# EAGLE design riffleito-REVG (EAGLE 6.5.0)
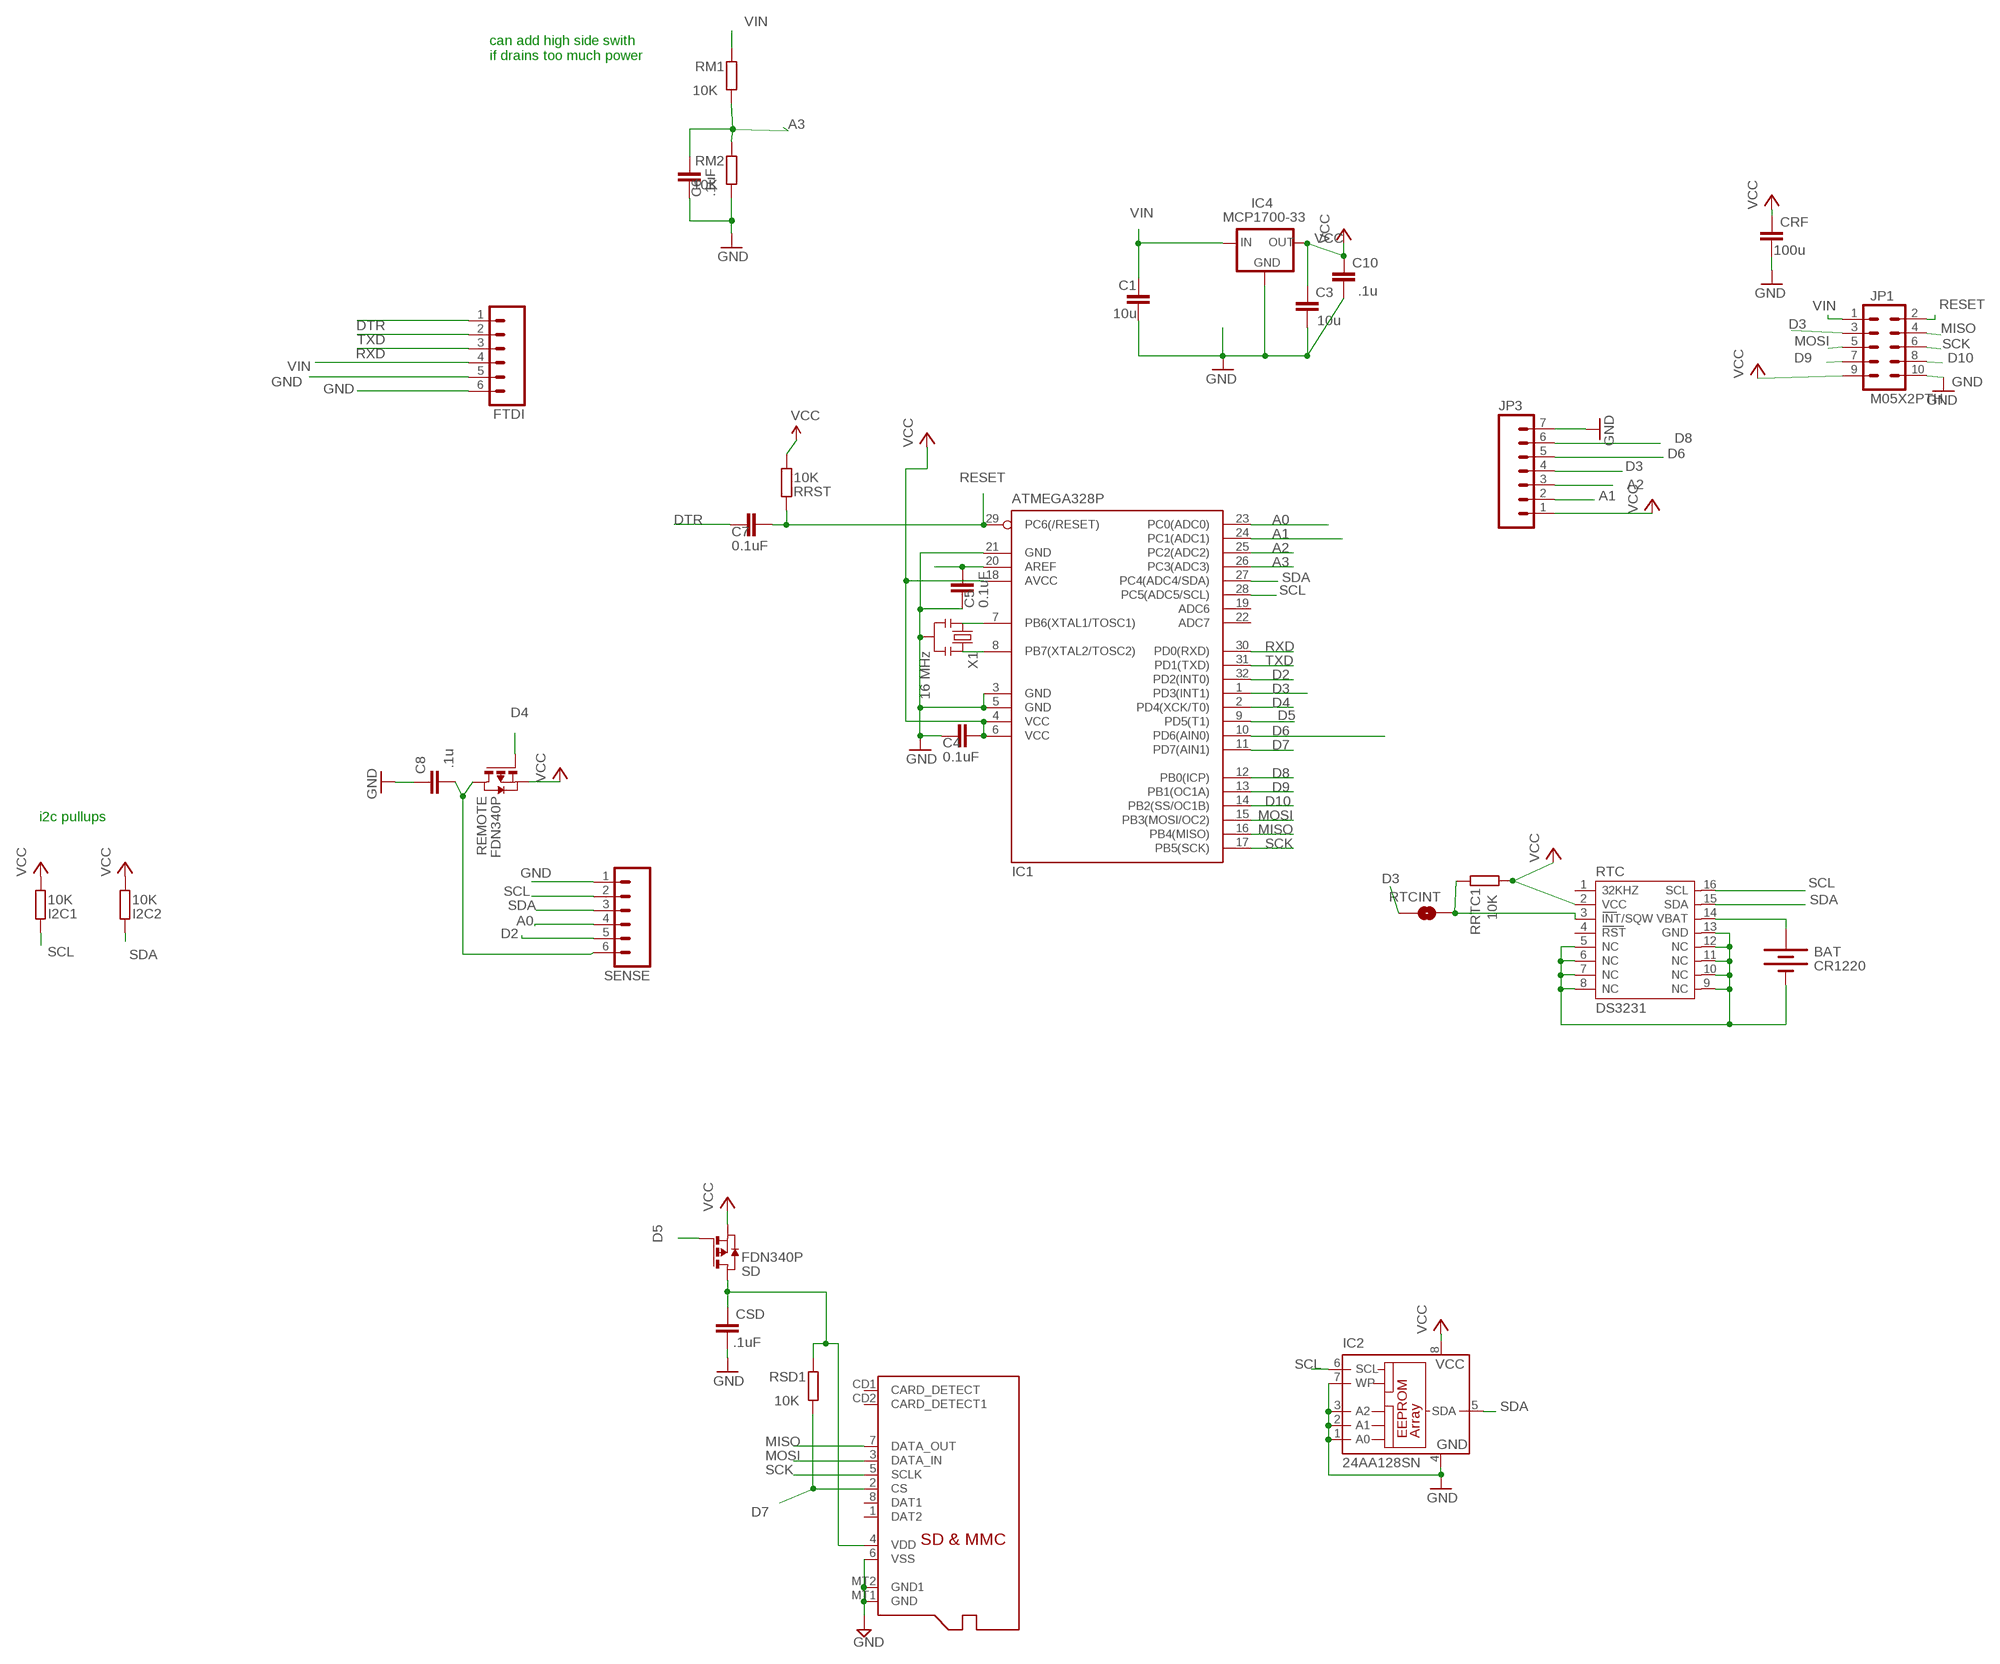
[diagram p0: schematic, sheet 1]

## Parts
BAT  CR1220  BATTERYBATTERY_12MM_SMT  [BATTCON_12MM_SMT]
C1  10u  C-EUC0805  [C0805]
C3  10u  C-EUC0805  [C0805]
C4  0.1uF  C-EUC0805  [C0805@1]
C5  0.1uF  C-EUC0805  [C0805@1]
C6  .1uF  C-EUC0805  [C0805@1]
C7  0.1uF  C-EUC0805  [C0805@1]
C8  .1u  C-EUC0805  [C0805]
C10  .1u  C-EUC0805  [C0805]
CRF  100u  C-EUC0805  [C0805]
CSD  .1uF  C-EUC0805  [C0805]
FTDI  M06SIP  [1X06]
I2C1  10K  R-EU_R0805  [R0805]
I2C2  10K  R-EU_R0805  [R0805]
IC1  ATMEGA328P  MEGA8-AI  [TQFP32-08]
IC2  24AA128SN  [SO-08]
IC4  MCP1700-33  MCP1700SOT233  [SOT23]
JP1  M05X2PTH  [AVR_ICSP]
JP3  M07  [1X07]
MICROSD  MICROSD  [MICROSD]
REMOTE  FDN340P  PMOSSOT23  [SOT-23]
RM1  10K  R-EU_R0805  [R0805]
RM2  10K  R-EU_R0805  [R0805]
RRST  10K  R-EU_R0805  [R0805]
RRTC1  10K  R-EU_R0805  [R0805]
RSD1  10K  R-EU_R0805  [R0805]
RTC  DS3231  [DS3231]
RTCINT  SOLDERJUMPERNO  [SJ_2S-NO]
SD  FDN340P  PMOSSOT23  [SOT-23]
SENSE  M06SIP  [1X06]
X1  16 MHz  RESONATORSMD  [RESONATOR-SMD]

## Nets
A0: IC1.23(PC0(ADC0)) SENSE.4
A1: IC1.24(PC1(ADC1)) JP3.2
A2: IC1.25(PC2(ADC2)) JP3.3
A3: C6.2 IC1.26(PC3(ADC3)) RM1.1 RM2.2
AREF: C5.2 IC1.20(AREF)
D2: IC1.32(PD2(INT0)) SENSE.5
D3: IC1.1(PD3(INT1)) JP1.3 JP3.4 RTCINT.2
D4: IC1.2(PD4(XCK/T0)) REMOTE.3(G)
D5: IC1.9(PD5(T1)) SD.3(G)
D6: IC1.10(PD6(AIN0)) JP3.5
D7: IC1.11(PD7(AIN1)) MICROSD.2(CS) RSD1.1
D8: IC1.12(PB0(ICP)) JP3.6
D9: IC1.13(PB1(OC1A)) JP1.7
D10: IC1.14(PB2(SS/OC1B)) JP1.8
DTR: C7.1 FTDI.1
GND: BAT.P$1(-) C1.2 C3.2 C4.1 C5.1 C6.1 C8.1 C10.2 CRF.2 CSD.2 FTDI.5 FTDI.6 IC1.3(GND) IC1.5(GND) IC1.21(GND) IC2.1(A0) IC2.2(A1) IC2.3(A2) IC2.4(GND) IC2.7(WP) IC4.1(GND) JP1.10 JP3.7 MICROSD.6(VSS) MICROSD.MT1(GND) MICROSD.MT2(GND1) RM2.1 RTC.5(NC) RTC.6(NC) RTC.7(NC) RTC.8(NC) RTC.9(NC) RTC.10(NC) RTC.11(NC) RTC.12(NC) RTC.13(GND) SENSE.1 X1.2
MISO: IC1.16(PB4(MISO)) JP1.4 MICROSD.7(DATA_OUT)
MOSI: IC1.15(PB3(MOSI/OC2)) JP1.5 MICROSD.3(DATA_IN)
N$1: RRTC1.2 RTC.3(INT/SQW) RTCINT.1
N$2: IC1.8(PB7(XTAL2/TOSC2)) X1.3
N$3: IC1.7(PB6(XTAL1/TOSC1)) X1.1
RESET: C7.2 IC1.29(PC6(/RESET)) JP1.2 RRST.2
RTC_BATT: BAT.P$2(+) RTC.14(VBAT)
RXD: FTDI.3 IC1.30(PD0(RXD))
SCK: IC1.17(PB5(SCK)) JP1.6 MICROSD.5(SCLK)
SCL: I2C1.2 IC1.28(PC5(ADC5/SCL)) IC2.6(SCL) RTC.16(SCL) SENSE.2
SDA: I2C2.2 IC1.27(PC4(ADC4/SDA)) IC2.5(SDA) RTC.15(SDA) SENSE.3
TXD: FTDI.2 IC1.31(PD1(TXD))
VCC: C3.1 C4.2 C8.2 C10.1 CRF.1 I2C1.1 I2C2.1 IC1.4(VCC) IC1.6(VCC) IC1.18(AVCC) IC2.8(VCC) IC4.2(OUT) JP1.9 JP3.1 REMOTE.1(D) REMOTE.2(S) RRST.1 RRTC1.1 RTC.2(VCC) SD.2(S) SENSE.6
VDD: CSD.1 MICROSD.4(VDD) RSD1.2 SD.1(D)
VIN [power]: C1.1 FTDI.4 IC4.3(IN) JP1.1 RM1.2
Unconnected: IC1.19(ADC6) IC1.22(ADC7) MICROSD.1(DAT2) MICROSD.8(DAT1) MICROSD.CD1(CARD_DETECT) MICROSD.CD2(CARD_DETECT1) RTC.1(32KHZ) RTC.4(RST)

## Notes on the sheet
- can add high side swith
  if drains too much power
- i2c pullups

## Library data of the parts
BAT = SparkFunNew:BATTERY: Battery Holders Various common sizes : AA, AAA, 20mm coin cell and 12mm coin cell.
C1 C3 C8 C10 CRF CSD = resistor:C-EU: CAPACITOR, European symbol
C4-C7 = rcl:C-EU: CAPACITOR, European symbol
FTDI SENSE = SparkFun-Connectors:M06: Header 6 Standard 6-pin 0.1" header. Use with straight break away headers (SKU : PRT-00116), right angle break away headers (PRT-00553), swiss pins (PRT-00743), machine pins (PRT-00117), and female headers (PRT-00115). Molex polarized connector foot print use with SKU : PRT-08094 with associated crimp pins and housings. NOTES ON THE VARIANTS LOCK and LOCK_LONGPADS... This footprint was designed to help hold the alignment of a through-hole component (i.e. 6-pin header) while soldering it into place. You may notice that each hole has been shifted either up or down by 0.005 of an inch from it's more standard position (which is a perfectly straight line). This slight alteration caused the pins (the squares in the middle) to touch the edges of the holes. Because they are alternating, it causes a "brace" to hold the component in place. 0.005 has proven to be the perfect amount of "off-center" position when using our standard breakaway headers. Although looks a little odd when you look at the bare footprint, once you have a header in there, the alteration is very hard to notice. Also,if you push a header all the way into place, it is covered up entirely on the bottom side. This idea of altering the position of holes to aid alignment will be further integrated into the Sparkfun Library for other footprints. It can help hold any component with 3 or more connection pins.
I2C1 I2C2 RM1 RM2 RRST RRTC1 RSD1 = rcl:R-EU_: RESISTOR, European symbol
IC1 = atmel:MEGA8: MICROCONTROLLER 8 Kbytes FLASH, 1 kbytes SRAM, 512 bytes EEPROM, USART, 6-channel 10 bit ADC, 2-channel 8 bit ADC Pin compatible with Atmega48, ATMega88, ATMega168 Source: avr.lbr; MPN: ATMEGA8-16AU; OC_FARNELL: 9171371; OC_NEWARK: 73M8863
IC2 = microchip:24*: Serial EEPROM I2C; MF: MICROCHIP; MPN: 24AA128-I/SN; OC_FARNELL: unknown; OC_NEWARK: 92C6842
IC4 = adafruit:MCP1700: VOLTAGE REGULATOR
JP1 = SparkFun-Connectors:M05X2: Header 5x2 Standard 10-pin dual row 0.1" header. Commonly used with AVR-ISP. Use with Spark Fun Electronics SKU: PRT-00778
JP3 = SparkFun-Connectors:M07: Header 7 Standard 7-pin 0.1" header. Use with straight break away headers (SKU : PRT-00116), right angle break away headers (PRT-00553), swiss pins (PRT-00743), machine pins (PRT-00117), and female headers (PRT-00115). NOTES ON THE VARIANTS LOCK and LOCK_LONGPADS... This footprint was designed to help hold the alignment of a through-hole component (i.e. 7-pin header) while soldering it into place. You may notice that each hole has been shifted either up or down by 0.005 of an inch from it's more standard position (which is usually a perfectly straight line). This slight alteration caused the pins (the squares in the middle) to touch the edges of the holes. Because they are alternating, it causes a "brace" to hold the header in place. 0.005 has proven to be the perfect amount of "off-center" position when using our standard breakaway headers. Although looks a little odd when you look at the bare footprint, once you have a header in there, the alteration is very hard to notice. Also, if you push a header all the way into place, it is covered up entirely on the bottom side. This idea of altering the position of holes to aid alignment will be further integrated into the Sparkfun Library for other footprints. It can help hold any component with 3 or more connection pins.
MICROSD = adafruit:MICROSD: Micro-SD / Transflash card holder with SPI pinout For the 3M # 2908-05WB-MG and/or 4UCON #19656 push-push type
REMOTE SD = zetex:PMOSSOT23: MOS FET
RTC = _lh-library:DS3231
RTCINT = _SparkFun:SOLDERJUMPER: Solder Jumper Standard SMD solder jumper. Used to automate production. Two varients : Normally Open and Normally Closed are the same, but have different paste layers. NC will have a large amount of paste and should jumper during reflow.
X1 = SparkFun:RESONATOR: Resonator Small SMD resonator. This is the itty bitty 10/20MHz resonators with built in caps. CSTCE10M0G55 and CSTCE20M0V53. Footprint has been reviewed closely but hasn't been tested yet.

## Net classes
0 default: width 0.203 mm, drill 0.33 mm, clearance 0.203 mm
1 power: width 0.381 mm, drill 0.33 mm, clearance 0.254 mm

## Board
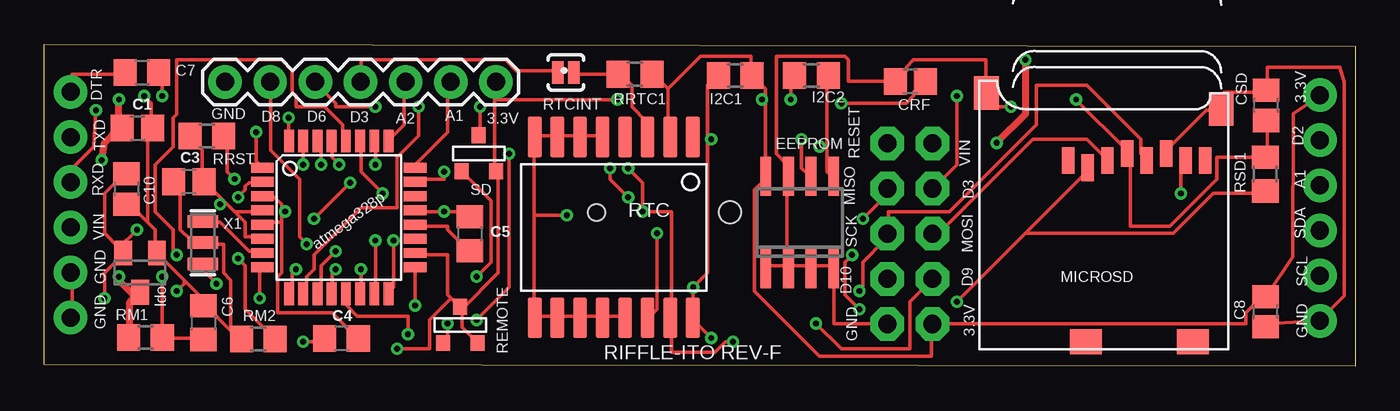
[diagram p1: board, top side]
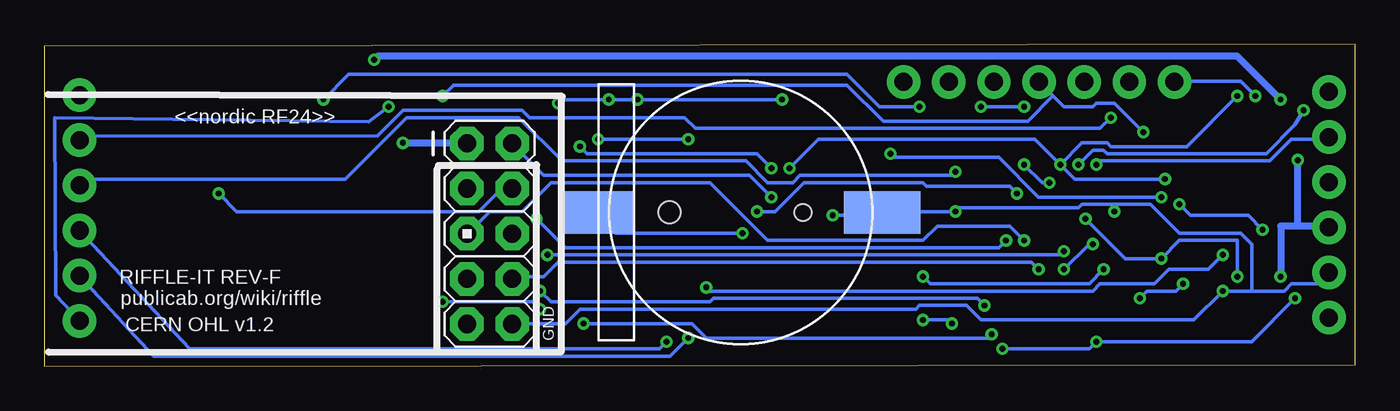
[diagram p2: board, bottom side, seen from below]

Size 73.74 x 18.11 mm. Coordinates in mm from the lower left corner, seen from the top.
Outline: 0,0.1 0,18.11 73.74,18.01 73.74,0 0,0.1
Copper layers (1*16): Top 0.0356mm / dielectric 1.5011mm / Bottom 0.0356mm
Design rules "LaenPCBOrder": minimum track width 6mil, minimum drill 13mil, track to track 6mil, track to pad 6mil, pad to pad 6mil, via to via 6mil, smd to smd 6mil, copper to edge 15mil, drill to drill 6mil, minimum pad ring 7mil, minimum via ring 7mil, stop-mask expansion 3mil, vias tented up to drill 0mil, thermal gap 10mil

### Footprints (pad centres in the part's own frame; a part is rotated, then mirrored left to right if it is on the bottom)
BATTCON_12MM_SMT = smd 2.4 x 4.3: P$1 0,11.96 | smd 2.4 x 4.2: P$2 0,-4.1 | hole 0.95: 0,7.5 | hole 1.25: 0,0
C0805 = smd 1.3 x 1.5: 1 -0.85,0; 2 0.85,0
C0805@1 = smd 1.3 x 1.5: 1 -0.95,0; 2 0.95,0
1X06 = drill 1.016 pad 1.88: 1 0,0; 2 2.54,0; 3 5.08,0; 4 7.62,0; 5 10.16,0; 6 12.7,0
R0805 = smd 1.3 x 1.5: 1 -0.95,0; 2 0.95,0
TQFP32-08 = smd 1.27 x 0.559: 1 -4.293,2.8; 2 -4.293,2; 3 -4.293,1.2; 4 -4.293,0.4; 5 -4.293,-0.4; 6 -4.293,-1.2; 7 -4.293,-2; 8 -4.293,-2.8; 17 4.293,-2.8; 18 4.293,-2; 19 4.293,-1.2; 20 4.293,-0.4; 21 4.293,0.4; 22 4.293,1.2; 23 4.293,2; 24 4.293,2.8 | smd 0.559 x 1.27: 9 -2.8,-4.293; 10 -2,-4.293; 11 -1.2,-4.293; 12 -0.4,-4.293; 13 0.4,-4.293; 14 1.2,-4.293; 15 2,-4.293; 16 2.8,-4.293; 25 2.8,4.293; 26 2,4.293; 27 1.2,4.293; 28 0.4,4.293; 29 -0.4,4.293; 30 -1.2,4.293; 31 -2,4.293; 32 -2.8,4.293
SO-08 = smd 0.6 x 2.2: 1 -1.905,-2.6; 2 -0.635,-2.6; 3 0.635,-2.6; 4 1.905,-2.6; 5 1.905,2.6; 6 0.635,2.6; 7 -0.635,2.6; 8 -1.905,2.6
SOT23 = smd 1 x 1.4: 1 -0.95,-1.1; 2 0.95,-1.1; 3 0,1.1
AVR_ICSP = drill 1.016 pad 1.88 octagon: 1 -1.27,5.08; 2 1.27,5.08; 3 -1.27,2.54; 4 1.27,2.54; 5 -1.27,0; 6 1.27,0; 7 -1.27,-2.54; 8 1.27,-2.54; 9 -1.27,-5.08; 10 1.27,-5.08
1X07 = drill 1.016 pad 1.88: 1 0,0; 2 2.54,0; 3 5.08,0; 4 7.62,0; 5 10.16,0; 6 12.7,0; 7 15.24,0
MICROSD = smd 0.7 x 1.5: 1 9,-10.64; 2 7.9,-10.24; 3 6.8,-10.64; 4 5.7,-11.04; 5 4.6,-10.64; 6 3.5,-11.04; 7 2.4,-10.64; 8 1.3,-10.64 | smd 1.8 x 1.4: CD1 2,-0.44; CD2 8,-0.44 | smd 1.4 x 1.9: MT1 0.4,-13.54; MT2 13.6,-14.44
SOT-23 = smd 0.787 x 0.889: 1 0.025,-1.016; 2 -0.94,1.016; 3 0.991,1.016
DS3231 = smd 0.762 x 2.286: 1 -4.445,-5.08; 2 -3.175,-5.08; 3 -1.905,-5.08; 4 -0.635,-5.08; 5 0.635,-5.08; 6 1.905,-5.08; 7 3.175,-5.08; 8 4.445,-5.08; 9 4.445,5.08; 10 3.175,5.08; 11 1.905,5.08; 12 0.635,5.08; 13 -0.635,5.08; 14 -1.905,5.08; 15 -3.175,5.08; 16 -4.445,5.08
SJ_2S-NO = smd 0.635 x 1.27: 1 -0.45,0; 2 0.45,0
RESONATOR-SMD = smd 0.7 x 1.7: 1 -1.2,0; 2 0,0; 3 1.2,0

### Placement (x,y rotation side)
BAT  38.56,8.66 270 bottom
C1  5.23,13.41 0 top
C3  8.13,10.39 180 top
C4  16.71,1.57 180 top
C5  23.93,7.47 270 top
C6  8.94,2.46 270 top
C7  5.49,16.54 0 top
C8  68.71,3.07 90 top
C10  4.62,9.98 270 top
CRF  48.72,16.03 180 top
CSD  68.73,14.68 90 top
FTDI  1.47,15.44 270 top
I2C1  38.86,16.36 180 top
I2C2  43.15,16.36 0 top
IC1  16.56,8.38 0 top
IC2  42.49,8.1 0 top
IC4  5.38,5.28 180 top
JP1  48.69,7.47 0 bottom
JP3  25.4,16 180 top
MICROSD  66.6,0.94 180 top
REMOTE  23.42,2.34 180 top
RM1  5.69,1.63 180 top
RM2  12.04,1.55 0 top
RRST  9.14,12.95 0 top
RRTC1  33.22,16.43 180 top
RSD1  68.68,10.82 90 top
RTC  32.03,7.82 180 top
RTCINT  29.34,16.54 180 top
SD  24.46,11.99 180 top
SENSE  71.75,2.57 90 top
X1  8.92,6.96 270 top

### Tracks (layer width: path | path; a pad name or v marks a point on that pad's centre or on a via)
A0  (via drill 0.33)
  Top 0.203: v22.48,10.95 22.48,10.54 20.85,10.54 IC1.23
  Bottom 0.203: v22.48,10.95 22.68,10.74 31.22,10.74 31.62,10.34 33.05,10.34 34.26,11.56 44.63,11.56 47.07,14 53.37,14 56.82,10.54 71.09,10.52 SENSE.4
A1
  Top 0.203: IC1.24 20.85,11.35 22.68,13.18 22.68,15.82 JP3.2
A2
  Top 0.203: IC1.25 19.43,12.78 20.24,13.59 20.24,15.82 JP3.3
A3  (via drill 0.33)
  Top 0.203: C6.2 8.86,1.6 6.83,1.6 RM1.1 6.63,1.8 v6.63,5.05 | v18.62,11.35 18.62,12.57 IC1.26 | v15.16,8.31 v17.2,10.34 | v10.9,6.07 11.3,5.66 11.3,3.23 12.93,1.6 RM2.2
  Bottom 0.203: v18.62,11.35 17.6,10.34 v17.2,10.34 | v15.16,8.31 12.93,6.07 v10.9,6.07 9.88,7.09 6.63,7.09 v6.63,5.05
AREF
  Top 0.203: IC1.20 20.85,7.9 22.68,7.9 22.68,7.7 23.9,6.48 C5.2
D2  (via drill 0.33)
  Top 0.203: v13.74,14 13.74,12.78 IC1.32
  Bottom 0.203: v13.74,14 14.35,13.39 37.11,13.39 37.72,14 46.46,14 46.86,14.4 53.57,14.4 54.99,12.98 71.25,12.95 SENSE.5
D3  (via drill 0.33)
  Top 0.203: v11.91,13.18 11.91,11.56 12.12,11.35 IC1.1 | RTCINT.2 28.78,16.64 26.54,16.64 25.93,17.25 17.81,17.25 17.81,16.03 JP3.4 | v51.33,15.21 51.33,11.35 50.11,10.13 JP1.3
  Bottom 0.203: v11.91,13.18 13.54,14.81 14.55,14.81 14.76,14.6 16.38,14.6 16.99,15.21 | JP3.4 16.99,15.21 | v51.33,15.21 50.72,15.82 28.57,15.82 26.54,13.79 18.41,13.79 16.99,15.21
D4  (via drill 0.33)
  Top 0.203: v22.68,2.41 22.68,1.6 22.48,1.4 REMOTE.3 | v24.31,2.62 26.14,4.44 v26.14,11.96 | v10.9,9.52 11.3,9.93 11.3,10.13 11.51,10.34 12.12,10.34 IC1.2
  Bottom 0.203: v22.68,2.41 22.89,2.62 v24.31,2.62 | v26.14,11.96 25.93,11.76 20.04,11.76 17.81,9.52 v10.9,9.52
D5  (via drill 0.33)
  Top 0.203: SD.3 25.12,9.32 25.12,5.87 v24.31,5.05 | v14.15,5.46 13.94,5.26 13.94,4.24 IC1.9
  Bottom 0.203: v24.31,5.05 23.9,4.65 14.96,4.65 v14.15,5.46
D6  (via drill 0.33)
  Top 0.203: v21.06,14.6 21.06,12.98 19.84,11.76 19.84,8.92 17.81,8.92 15.16,6.27 15.16,5.46 14.76,5.05 14.76,4.24 IC1.10 | v18.62,14.6 16.38,14.6 16.38,14.81 15.37,15.82 JP3.5
  Bottom 0.203: v18.62,14.6 v21.06,14.6
D7  (via drill 0.33)
  Top 0.203: v16.38,6.48 15.57,5.66 15.57,4.44 15.37,4.24 IC1.11 | v45.44,6.27 45.03,5.87 45.03,4.04 v45.85,3.23 | 55.19,7.49 58.65,10.95 58.65,11.15 MICROSD.2 | 55.19,7.49 v51.33,3.63 | 55.19,7.49 63.53,7.49 65.76,9.73 68.61,9.73 RSD1.1
  Bottom 0.203: v16.38,6.48 16.59,6.27 v45.44,6.27 | v45.85,3.23 46.25,3.63 v51.33,3.63
D8  (via drill 0.33)
  Top 0.203: v16.38,5.46 16.18,5.26 16.18,4.24 IC1.12 | v14.76,6.88 14.35,7.29 14.35,10.54 12.73,12.17 12.73,15.82 JP3.6
  Bottom 0.203: v16.38,5.46 14.96,6.88 v14.76,6.88
D9  (via drill 0.33)
  Top 0.203: v20.45,1.8 20.45,2.82 17.6,2.82 16.99,3.43 16.99,4.04 IC1.13 | v43.41,2.41 44.83,0.99 48.69,0.99 48.69,3.63 49.91,4.85 JP1.7
  Bottom 0.203: v20.45,1.8 20.65,1.6 36.5,1.6 37.31,2.41 v43.41,2.41
D10  (via drill 0.33)
  Top 0.203: v17.81,5.46 17.81,4.24 IC1.14
  Bottom 0.203: v17.81,5.46 18.21,5.87 44.83,5.87 45.64,5.05 47.27,5.05 JP1.8
DTR
  Top 0.203: C7.1 4.39,16.43 1.55,16.43 1.55,15.62 FTDI.1
GND  (via drill 0.33)
  Top 0.203: SENSE.1 68.81,2.41 C8.1 | 71.78,2.59 SENSE.1 | MICROSD.6 63.12,12.17 65.35,14.4 66.17,14.4 MICROSD.MT1 66.37,14.6 66.37,15.42 68.61,15.42 CSD.2 68.81,15.62 68.81,16.84 72.87,16.84 73.13,15.98 73.13,3.99 SENSE.1 | IC2.4 44.22,5.66 43.21,5.66 IC2.3 43,5.66 41.99,5.66 IC2.2 41.78,5.66 | 44.42,5.66 IC2.4 | 41.78,5.66 40.77,5.66 IC2.1 | 41.78,5.66 41.78,10.54 IC2.7 41.78,10.74 41.78,11.35 41.17,11.96 41.17,17.45 45.03,17.45 45.24,17.25 45.24,16.03 CRF.2 47.88,16.03 48.49,16.64 48.49,16.84 48.89,17.25 52.96,17.25 52.96,15.42 MICROSD.MT2 53.16,15.21 53.16,14.6 v54.38,14.6 | JP1.10 47.27,2.41 44.42,2.41 44.42,5.46 IC2.4 | RTC.5 31.22,12.98 30.2,12.98 RTC.6 30,12.98 28.98,12.98 RTC.7 28.78,12.98 27.76,12.98 RTC.8 27.56,12.78 27.56,8.51 | RTC.13 32.64,2.82 31.42,2.82 RTC.12 31.22,2.82 30.2,2.82 RTC.11 30,2.82 28.98,2.82 RTC.10 28.78,2.82 27.76,2.82 RTC.9 27.56,2.82 27.56,8.51 | 13.33,8.1 12.32,8.1 IC1.5 | 13.33,8.71 13.33,9.12 12.93,9.52 12.32,9.52 IC1.3 | 13.33,8.71 13.33,8.1 | 13.33,8.1 13.33,5.26 13.13,5.05 13.13,3.02 16.18,3.02 17.6,1.6 C4.1 | 20.85,8.92 IC1.21 20.85,8.71 v22.48,8.71 23.9,8.71 23.9,8.51 C5.1 | FTDI.6 1.55,2.82 1.55,5.26 FTDI.5 | C3.2 7.44,10.34 7.65,10.13 7.65,7.7 8.25,7.09 8.86,7.09 X1.2 9.07,6.88 10.08,6.88 10.08,5.26 10.49,4.85 10.49,2.01 | 7.85,4.85 8.86,3.84 8.86,3.43 C6.1 9.07,3.43 10.49,2.01 | 7.85,4.85 6.43,6.27 IC4.1 6.22,6.48 6.22,7.7 5.82,8.1 | 10.49,2.01 10.9,1.6 RM2.1 10.49,2.01 | 5.82,8.1 4.8,9.12 C10.2 | 5.82,8.1 5.82,13.18 6.02,13.39 C1.2 6.02,13.59 6.02,14.81 v5.61,15.21 | v7.44,4.24 7.85,4.65 7.85,4.85 | v13.54,8.71 13.33,8.71
  Top 0.203: v29.39,8.51 27.56,8.51
  Bottom 0.203: SENSE.1 73.1,4.01 73.15,14 55.5,13.77 v54.38,14.6 | v5.61,15.21 6.43,16.03 10.08,16.03 JP3.7 | 5.82,4.24 v7.44,4.24 9.07,2.62 21.06,2.62 21.87,3.43 24.51,3.43 24.71,3.23 43.61,3.23 44.42,2.41 47.27,2.41 JP1.10 | 5.82,4.24 3.99,4.24 3.58,4.65 2.16,4.65 1.55,5.26 FTDI.5 | 13.54,9.12 11.51,9.12 9.88,7.49 6.43,7.49 5.82,6.88 5.82,4.24 | 13.54,9.12 15.37,9.12 15.57,8.92 22.28,8.92 v22.48,8.71 26.54,8.71 BAT.P$1 26.75,8.51 v29.39,8.51 | 13.54,9.12 v13.54,8.71
MISO  (via drill 0.33)
  Top 0.203: v19.63,7.09 19.63,4.44 19.43,4.24 IC1.16 | v46.05,8.31 47.27,9.52 47.27,9.93 JP1.4 | v63.93,9.73 63.93,11.35 64.13,11.56 MICROSD.7
  Bottom 0.203: v19.63,7.09 20.04,6.68 44.42,6.68 v46.05,8.31 | v63.93,9.73 62.92,8.71 49.3,8.71 48.08,9.93 47.47,9.93 JP1.4
MOSI  (via drill 0.33)
  Top 0.203: v18.62,7.09 18.62,4.24 IC1.15 | MICROSD.3 59.66,11.76 58.65,12.78 55.6,12.78 50.11,7.29 JP1.5
  Bottom 0.203: v18.62,7.09 19.43,7.9 23.49,7.9 24.31,7.09 33.05,7.09 36.3,10.34 45.24,10.34 46.86,8.71 48.69,8.71 49.91,7.49 JP1.5
N$1
  Top 0.203: RTCINT.1 29.79,16.43 RRTC1.2 32.44,16.43 33.05,15.82 33.05,14.6 33.86,13.79 33.86,12.98 RTC.3
N$2  (via drill 0.33)
  Top 0.203: v12.12,3.84 12.12,5.46 IC1.8 | v9.68,4.65 9.07,5.26 9.07,5.66 X1.3
  Bottom 0.203: v12.12,3.84 11.71,4.24 10.08,4.24 v9.68,4.65
N$3
  Top 0.203: IC1.7 12.12,6.48 11.51,6.48 9.88,8.1 9.07,8.1 X1.1
RESET  (via drill 0.33)
  Top 0.203: v16.59,11.35 16.18,11.76 16.18,12.57 IC1.29 | v10.69,10.54 10.29,10.95 10.29,12.78 RRST.2 | v6.63,15.21 6.63,16.43 C7.2 | v32.84,9.52 31.83,10.54 v31.83,11.15
  Bottom 0.203: v16.59,11.35 15.77,10.54 v10.69,10.54 | v6.63,15.21 9.47,12.37 13.74,12.37 13.94,12.57 15.37,12.57 v16.59,11.35 | v32.84,9.52 34.06,10.74 45.64,10.74 47.27,12.37 JP1.2 | v31.83,11.15 30.2,12.78 18.01,12.78 v16.59,11.35
RTC_BATT  (via drill 0.33)
  Top 0.203: v34.47,7.49 34.47,3.23 34.06,2.82 RTC.14
  Bottom 0.203: v34.47,7.49 41.58,7.49 42.6,8.51 BAT.P$2
RXD  (via drill 0.33)
  Top 0.203: v15.57,11.35 15.57,12.37 15.37,12.57 IC1.30 | v2.9,14.4 2.82,13.41 2.77,12.37 1.55,11.15 1.55,10.54 FTDI.3
  Bottom 0.203: v15.57,11.35 14.76,12.17 14.15,12.17 13.94,11.96 5,11.96 3.38,13.59 v2.9,14.4
SCK  (via drill 0.33)
  Top 0.203: v20.85,3.43 IC1.17 | v45.85,4.24 46.05,4.44 46.05,5.87 47.27,7.09 47.27,7.29 JP1.6 47.47,7.49 47.47,8.71 50.93,8.71 55.8,13.59 55.8,15.82 58.65,15.82 61.7,12.78 61.7,11.96 61.9,11.76 MICROSD.5
  Bottom 0.203: v20.85,3.43 21.26,3.84 36.09,3.84 36.3,3.63 45.24,3.63 v45.85,4.24
SCL  (via drill 0.33)
  Top 0.203: v7.44,6.27 7.24,6.48 7.24,7.7 6.22,8.71 6.22,11.35 7.24,12.37 7.24,14 7.44,14.2 7.44,17.25 13.33,17.25 13.94,16.64 13.94,15.42 14.15,15.21 14.15,14.6 15.77,14.6 16.79,13.59 16.79,12.78 IC1.28 | 37.31,12.78 37.31,5.26 v36.5,4.44 36.5,2.82 RTC.16 36.5,2.62 v37.52,1.6 | 37.31,12.78 37.31,15.82 37.72,16.23 I2C1.2 | v42.6,12.78 42.6,11.15 43,10.74 IC2.6 | 37.31,12.78 v37.52,12.78
  Bottom 0.203: v7.44,6.27 8.25,5.46 10.49,5.46 11.3,4.65 14.35,4.65 14.76,4.24 36.3,4.24 v36.5,4.44 | v37.52,12.78 v42.6,12.78 | v37.52,1.6 38.53,0.58 67.59,0.58 71.7,5 SENSE.2
SDA  (via drill 0.33)
  Top 0.203: 44.02,12.37 44.02,10.95 44.22,10.74 IC2.5 | 44.02,12.37 44.02,16.23 I2C2.2 | v19.02,9.73 17.81,10.95 17.81,12.57 IC1.27 | v38.73,1.4 38.33,1.4 37.72,0.79 35.28,0.79 35.28,2.62 RTC.15 35.28,2.82 35.28,8.71 v33.65,8.71 33.65,10.34 v32.84,11.15 | v43.61,12.37 44.02,12.37
  Bottom 0.203: v19.02,9.73 19.43,10.13 24.1,10.13 24.31,10.34 31.01,10.34 32.64,8.71 v33.65,8.71 | SENSE.3 65.56,0.99 39.14,0.99 v38.73,1.4 | v43.61,12.37 43.21,11.96 33.65,11.96 v32.84,11.15
TXD  (via drill 0.33)
  Top 0.203: v14.55,11.35 14.55,12.57 IC1.31
  Bottom 0.203: v14.55,11.35 14.35,11.56 4.8,11.56 3.58,12.78 1.55,12.78 FTDI.2
VCC  (via drill 0.33)
  Top 0.203: 25.32,15.01 25.32,15.82 JP3.1 | 25.32,15.01 25.32,11.15 SD.2 25.53,10.95 25.53,5.26 23.49,3.23 | 10.08,9.32 9.07,10.34 C3.1 8.86,10.54 8.86,12.17 8.25,12.78 RRST.1 | 10.08,9.32 10.69,8.71 | 10.69,8.71 11.3,8.1 11.3,7.29 12.12,7.29 IC1.6 | 10.69,8.71 12.12,8.71 IC1.4 | 4.19,6.68 3.38,7.49 3.38,9.73 4.6,10.95 C10.1 | 4.19,6.68 4.39,6.48 IC4.2 | 23.49,3.23 23.49,2.21 24.31,1.4 REMOTE.2 | 22.89,3.84 23.29,3.43 REMOTE.1 23.49,3.23 | 22.89,3.84 22.68,4.04 22.68,6.27 20.85,6.27 IC1.18 | v14.55,1.4 15.57,1.4 C4.2 | v19.84,0.99 21.67,0.99 21.67,2.62 22.89,3.84 | v3.38,3.84 3.38,5.26 4.39,6.27 IC4.2 | v9.88,9.12 10.08,9.32 | 4.19,6.68 v5.21,7.7 | 4.19,6.68 IC4.2 | 35.08,15.62 34.26,16.43 RRTC1.1 | 35.08,15.62 35.08,12.98 RTC.2 | 40.56,15.01 40.56,10.74 IC2.8 40.56,10.54 39.95,9.93 39.95,4.24 43.61,0.58 49.91,0.58 49.91,2.21 JP1.9 50.11,2.41 67.59,2.41 67.59,3.02 68.61,4.04 C8.2 68.81,4.04 70.23,6.17 70.26,14.22 71.63,15.14 SENSE.6 | 40.56,15.01 40.56,15.62 39.95,16.23 I2C1.1 39.75,16.43 39.75,17.45 36.91,17.45 35.08,15.62 | v41.99,15.01 41.99,16.03 42.19,16.23 I2C2.1 | 40.56,15.01 v40.36,15.01 | v44.83,14.81 48.49,14.81 48.89,15.21 48.89,15.42 49.5,16.03 CRF.1 | v32.23,15.01 25.32,15.01
  Bottom 0.203: v19.84,0.99 14.96,0.99 v14.55,1.4 5.82,1.4 v3.38,3.84 | v9.88,9.12 9.27,8.51 6.02,8.51 v5.21,7.7 | v44.83,14.81 44.63,15.01 v41.99,15.01 v40.36,15.01 v32.23,15.01
VDD  (via drill 0.33)
  Top 0.203: CSD.1 68.81,13.79 68.81,11.96 RSD1.2 68.61,11.76 65.96,11.76 65.96,10.54 63.32,7.9 61.09,7.9 61.09,11.96 MICROSD.4 60.88,12.17 v58.04,15.01 | v24.51,14.6 24.51,13.18 SD.1
  Bottom 0.203: v24.51,14.6 26.75,14.6 28.57,16.43 56.62,16.43 v58.04,15.01
VIN  (via drill 0.33)
  Top 0.381: RM1.2 4.8,1.8 4.8,3.63 5.21,4.04 IC4.3 5,4.04 4.19,4.85 v4.19,5.05 | v3.23,11.61 3.38,12.57 4.19,13.39 C1.1 4.19,13.59 v4.19,15.01 | v53.57,12.57 55.19,14.2 v55.19,17.25
  Bottom 0.381: 3.23,7.9 v3.23,11.61 | 3.23,7.9 1.55,7.9 FTDI.4 | v4.19,5.05 4.19,7.9 3.23,7.9 | v53.57,12.57 50.11,12.57 JP1.1 | v55.19,17.25 54.99,17.45 6.63,17.45 v4.19,15.01

### Text on the board
tPlace: 3.3V | DTR | GND | D8 | D6 | D3 | A1 | 3.3V | RESET | A2 | VIN | D2 | TXD | EEPROM | MISO | A1 | atmega328p | D3 | RXD | SDA | SCK | MOSI | VIN | SCL | D10 | D9 | GND | ldo | GND | 3.3V | GND | GND | RIFFLE-ITO REV-F
bPlace: <<nordic RF24>> | RIFFLE-IT REV-F | GND | publicab.org/wiki/riffle | CERN OHL v1.2